# EAGLE design ir_single_long (EAGLE 6.1)
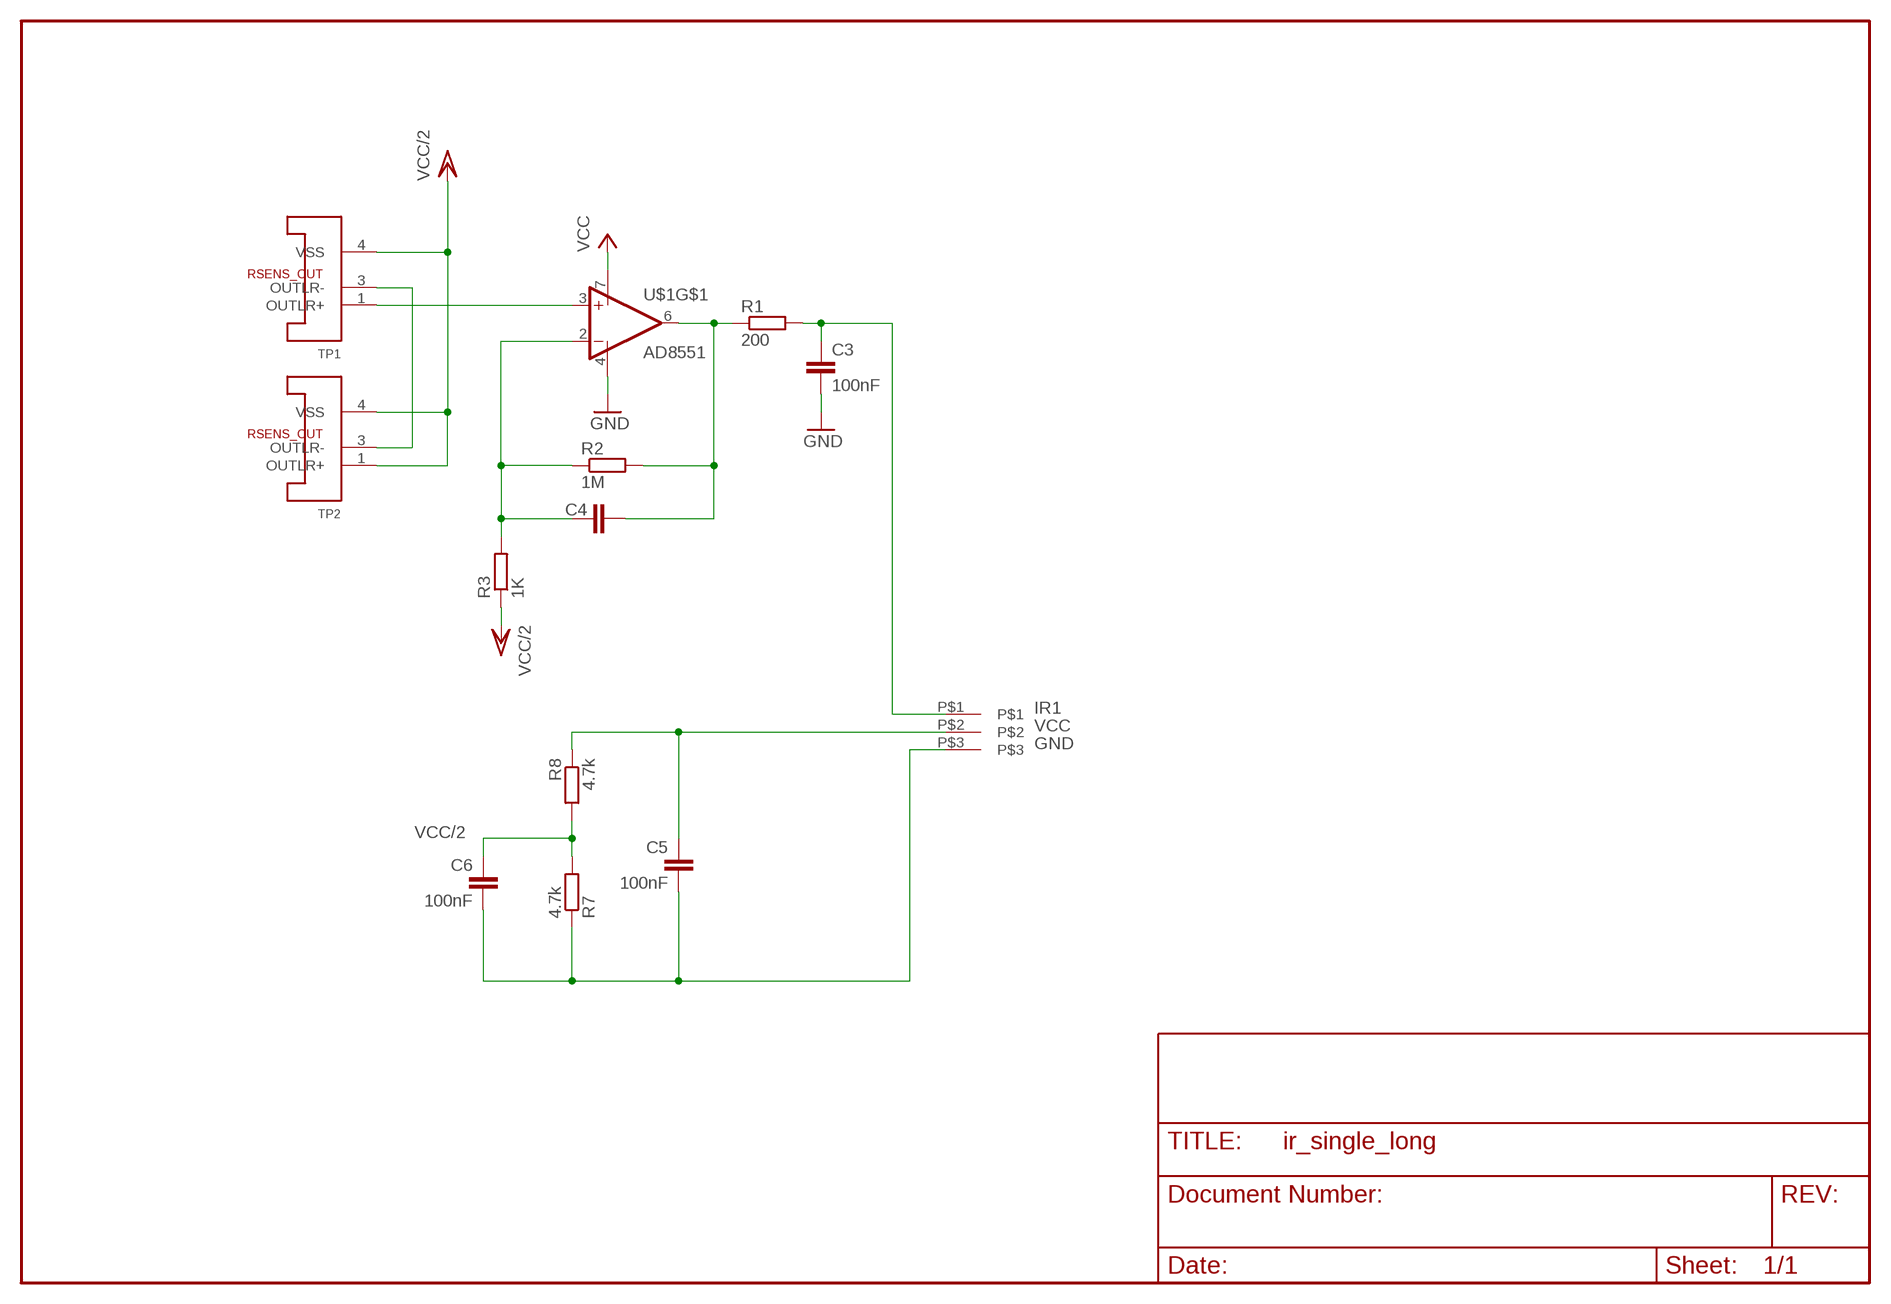
[diagram p0: schematic, sheet 1]

## Parts
C3  100nF  C-EUC1206K  [C1206K]
C4  C-EUC0603  [C0603]
C5  100nF  C-EUC0603  [C0603]
C6  100nF  C-EUC0603  [C0603]
R1  200  R-EU_R0603  [R0603]
R2  1M  R-EU_R0603  [R0603]
R3  1K  R-EU_R0603  [R0603]
R7  4.7k  R-EU_R0603  [R0603]
R8  4.7k  R-EU_R0603  [R0603]
TP1  MLX90247SMD_LONG  [T0_39_SMD_LONG]
TP2  MLX90247SMD_LONG  [T0_39_SMD_LONG]
U$1  AD8551  [MSOP8]
U$2  SOLD_PAD_3  [SOLD_PAD_2MM_3]

## Nets
GND: C3.2 C5.2 C6.2 R7.1 U$1.4(V-) U$2.P$3
IR1: C3.1 R1.2 U$2.P$1
N$2: TP1.3(OUTLR-) TP2.3(OUTLR-)
N$8: C4.2 R1.1 R2.2 U$1.6(OUT)
N$11: TP1.1(OUTLR+) U$1.3(+IN)
N$125: C4.1 R2.1 R3.2 U$1.2(-IN)
VCC: C5.1 R8.1 U$1.7(V+) U$2.P$2
VCC/2: C6.1 R3.1 R7.2 R8.2 TP1.4(VSS) TP2.1(OUTLR+) TP2.4(VSS)

## Library data of the parts
C3-C6 = rcl:C-EU: CAPACITOR, European symbol
R1-R3 R7 R8 = rcl:R-EU_: RESISTOR, European symbol
TP1 TP2 = paparazzi:MLX90247: Thermopile sensor
U$1 = paparazzi:AD8551
U$2 = paparazzi:SOLD_PAD_3

## Board
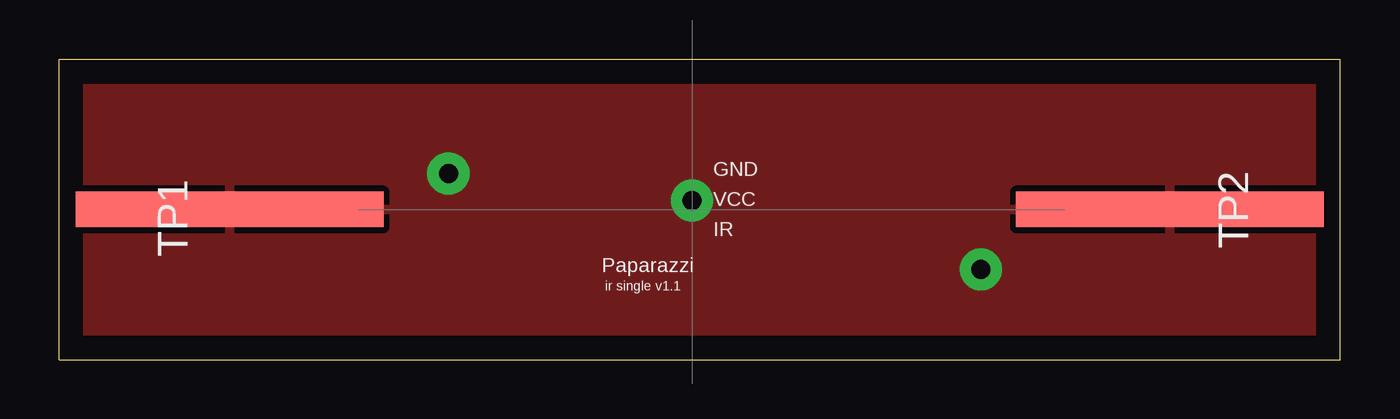
[diagram p1: board, top side]
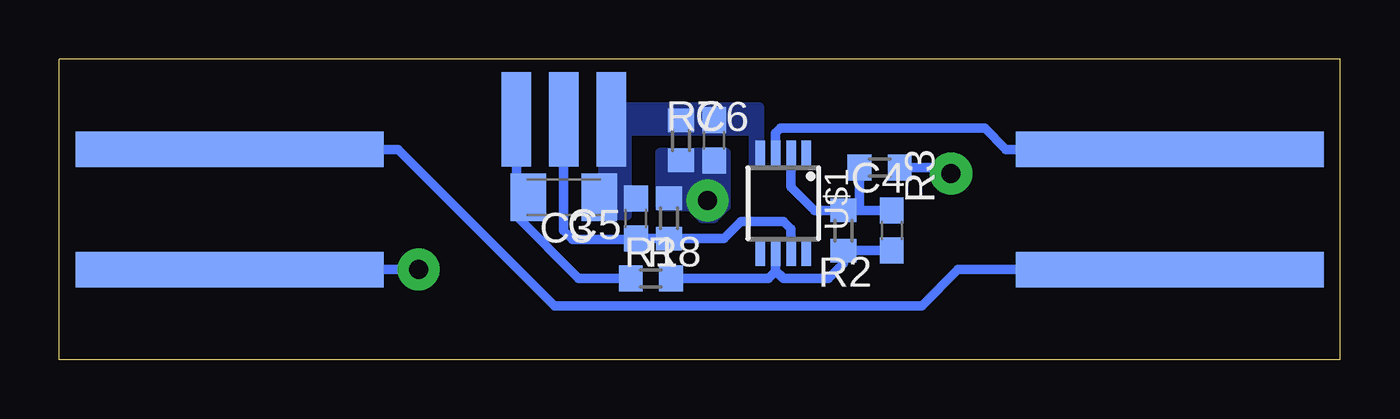
[diagram p2: board, bottom side, seen from below]

Size 54.08 x 12.7 mm. Coordinates in mm from the lower left corner, seen from the top.
Outline: 54.08,0 54.08,12.7 0,12.7 0,0 54.08,0
Copper layers (1*16): Top 0.035mm / dielectric 1.5mm / Bottom 0.035mm
Design rules: minimum track width 6mil, minimum drill 12mil, track to track 6mil, track to pad 6mil, pad to pad 6mil, via to via 6mil, smd to smd 6mil, copper to edge 40mil, drill to drill 8mil, minimum pad ring 10mil, minimum via ring 8mil, stop-mask expansion 4mil, vias tented up to drill 0mil, thermal gap 10mil

### Footprints (pad centres in the part's own frame; a part is rotated, then mirrored left to right if it is on the bottom)
C1206K = smd 1.5 x 2: 1 -1.5,0; 2 1.5,0
C0603 = smd 1.1 x 1: 1 -0.85,0; 2 0.85,0
R0603 = smd 1 x 1.1: 1 -0.85,0; 2 0.85,0
T0_39_SMD_LONG = smd 1.5 x 13 bottom: 1 2.54,0; 3 -2.54,0 | smd 1.5 x 13: 4 0,0
MSOP8 = smd 0.4 x 1.2: 1 -0.975,-2.05; 2 -0.325,-2.05; 3 0.325,-2.05; 4 0.975,-2.05; 5 0.975,2.05; 6 0.325,2.05; 7 -0.325,2.05; 8 -0.975,2.05
SOLD_PAD_2MM_3 = smd 1.25 x 4: P$1 -2,0; P$2 0,0; P$3 2,0

### Placement (x,y rotation side)
C3  32.78,6.86 0 bottom
C4  18.94,5.46 270 bottom
C5  29.74,5.97 90 bottom
C6  26.43,9.27 90 bottom
R1  29.1,3.43 180 bottom
R2  20.97,5.46 270 bottom
R3  19.45,8.13 180 bottom
R7  27.83,9.27 270 bottom
R8  28.34,5.97 90 bottom
TP1  7.19,6.35 90 top
TP2  46.89,6.35 270 top
U$1  23.51,6.6 180 bottom
U$2  32.78,10.16 0 bottom

### Tracks (layer width: path | path; a pad name or v marks a point on that pad's centre or on a via)
GND
  pour Bottom (no thermals): 24.53,10.67 31.13,10.67 31.13,6.1 30.12,6.1 30.12,9.65 24.78,9.65 24.78,8.26 24.53,8.26
IR1
  Bottom 0.406: R1.2 32.15,3.43 34.78,6.06 34.78,6.86 | 34.78,6.86 U$2.P$1 | 34.78,6.86 34.82,6.86 | 34.78,6.86 C3.1
N$2
  Bottom 0.406: TP1.3 16.15,3.81 17.67,2.29 33.16,2.29 39.77,8.89 TP2.3
N$8
  Bottom 0.406: 20.97,4.57 20.97,4.06 21.61,3.43 23.51,3.43 23.84,3.75 U$1.6 23.84,3.74 24.15,3.43 R1.1 | 20.97,4.57 R2.2 | C4.2 20.93,4.61 20.97,4.57
N$11
  Bottom 0.406: U$1.3 23.84,9.58 23.64,9.78 15,9.78 14.11,8.89 TP1.1
N$125
  Bottom 0.406: U$1.2 23.19,7.29 22.2,6.31 R2.1 20.21,6.31 | 20.21,6.31 18.98,6.31 18.94,6.35 | C4.1 18.94,6.35 | 18.94,6.35 18.9,6.31 | 20.21,6.31 20.21,6.35 20.3,6.44 R3.2
VCC
  Bottom 0.406: U$2.P$2 32.78,5.46 32.4,5.08 29.74,5.08 C5.1 28.25,5.12 | U$1.7 23.19,5.52 23.51,5.84 25.29,5.84 26.01,5.12 R8.1 28.25,5.12 | 28.25,5.12 28.21,5.08
VCC/2  (via drill 0.8 pad 1.78)
  Bottom 0.406: 38.88,3.81 v38.91,3.81 TP2.1 | v16.43,7.87 16.4,7.87 16.66,8.13 R3.1
  other vias: 26.72,6.73
  pour Top (isolate 0.305): 0.02,12.7 54.07,12.7 54.07,0 0.02,0
  pour Bottom (no thermals): 25.93,8.76 28.72,8.76 28.72,6.48 27.45,6.48 26.94,5.97 26.43,5.97 25.93,6.48

### Text on the board
tNames: GND | VCC | IR | Paparazzi | ir single v1.1